# EAGLE schematic NiceClock (EAGLE 7.2.0)
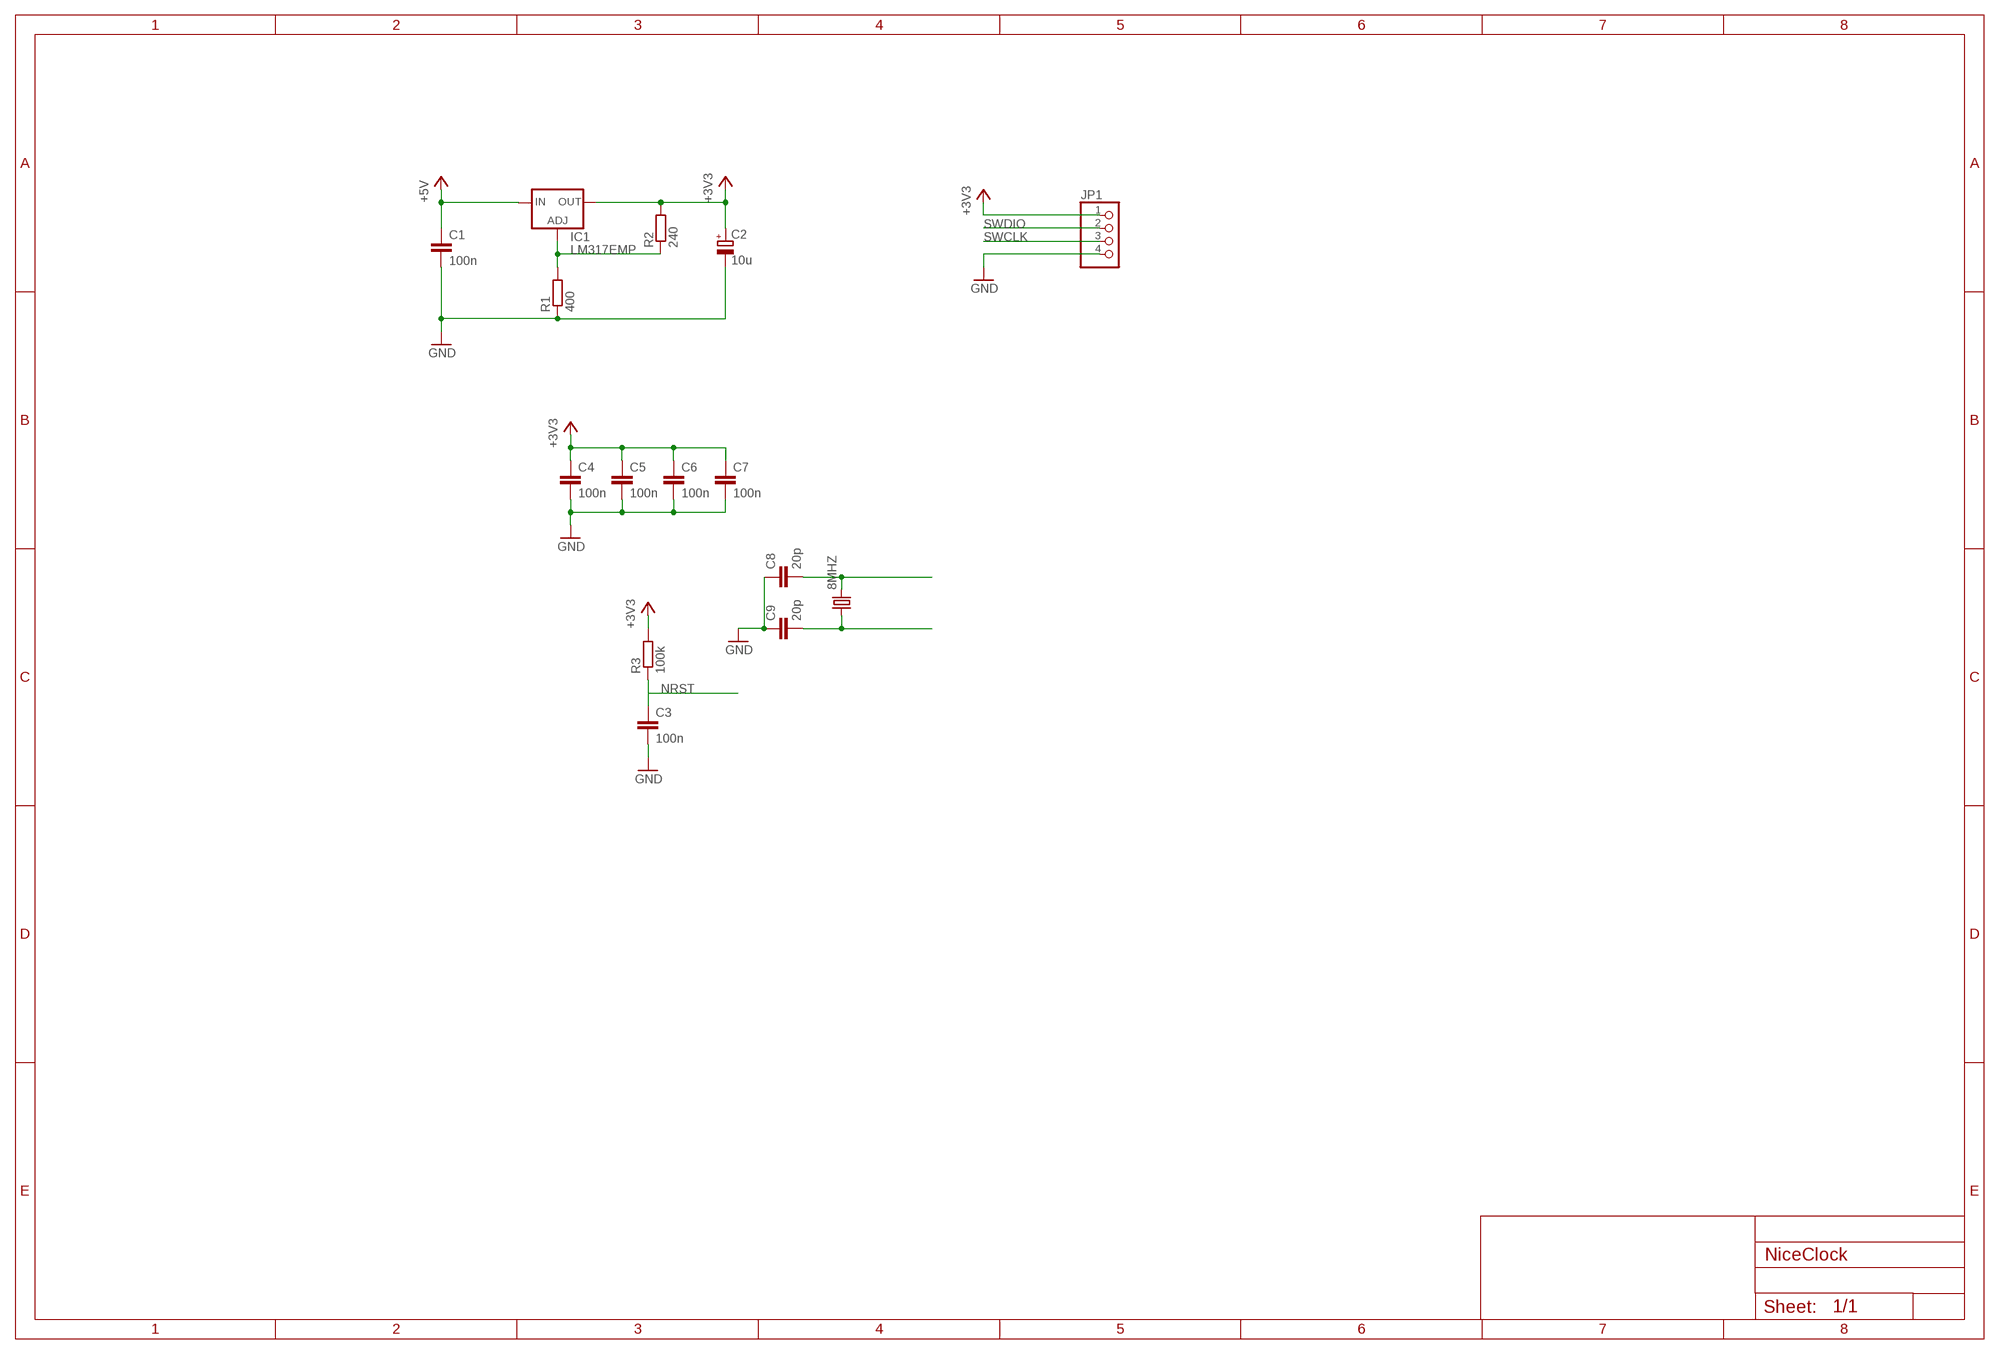
[diagram p0: schematic, sheet 1]

## Parts
8MHZ  CRYSTALHC49UP  [HC49UP]
C1  100n  C-EUC0603  [C0603]
C2  10u  CPOL-EUC/6032-28W  [C/6032-28W]
C3  100n  C-EUC0603  [C0603]
C4  100n  C-EUC0603  [C0603]
C5  100n  C-EUC0603  [C0603]
C6  100n  C-EUC0603  [C0603]
C7  100n  C-EUC0603  [C0603]
C8  20p  C-EUC0603  [C0603]
C9  20p  C-EUC0603  [C0603]
IC1  LM317EMP  LM317MSTT3  [SOT223]
JP1  PINHD-1X4/90  [1X04/90]
R1  400  R-EU_R0603  [R0603]
R2  240  R-EU_R0603  [R0603]
R3  100k  R-EU_R0603  [R0603]

## Nets
+3V3: C2.+ C4.1 C5.1 C6.1 C7.1 IC1.4(OUT) JP1.1 R2.2 R3.2
+5V: C1.1 IC1.3(IN)
GND: C1.2 C2.- C3.2 C4.2 C5.2 C6.2 C7.2 C8.1 C9.1 JP1.4 R1.1
N$1: IC1.1(ADJ) R1.2 R2.1
N$3: 8MHZ.1 C9.2
N$4: 8MHZ.2 C8.2
NRST: C3.1 R3.1
SWCLK: JP1.3
SWDIO: JP1.2

## Library data of the parts
8MHZ = crystal:CRYSTAL: CRYSTAL; OC_FARNELL: unknown; OC_NEWARK: unknown
C1 C3-C9 = rcl:C-EU: CAPACITOR, European symbol
C2 = rcl:CPOL-EU: POLARIZED CAPACITOR, European symbol
IC1 = v-reg:LM317?*: 500 mA Adjustable Output Positive Voltage Regulator Source: http://www.onsemi.co.jp .. LM317M-D.PDF
JP1 = pinhead:PINHD-1X4: PIN HEADER
R1-R3 = rcl:R-EU_: RESISTOR, European symbol